# EAGLE design PR9010 (EAGLE 6.6.0)
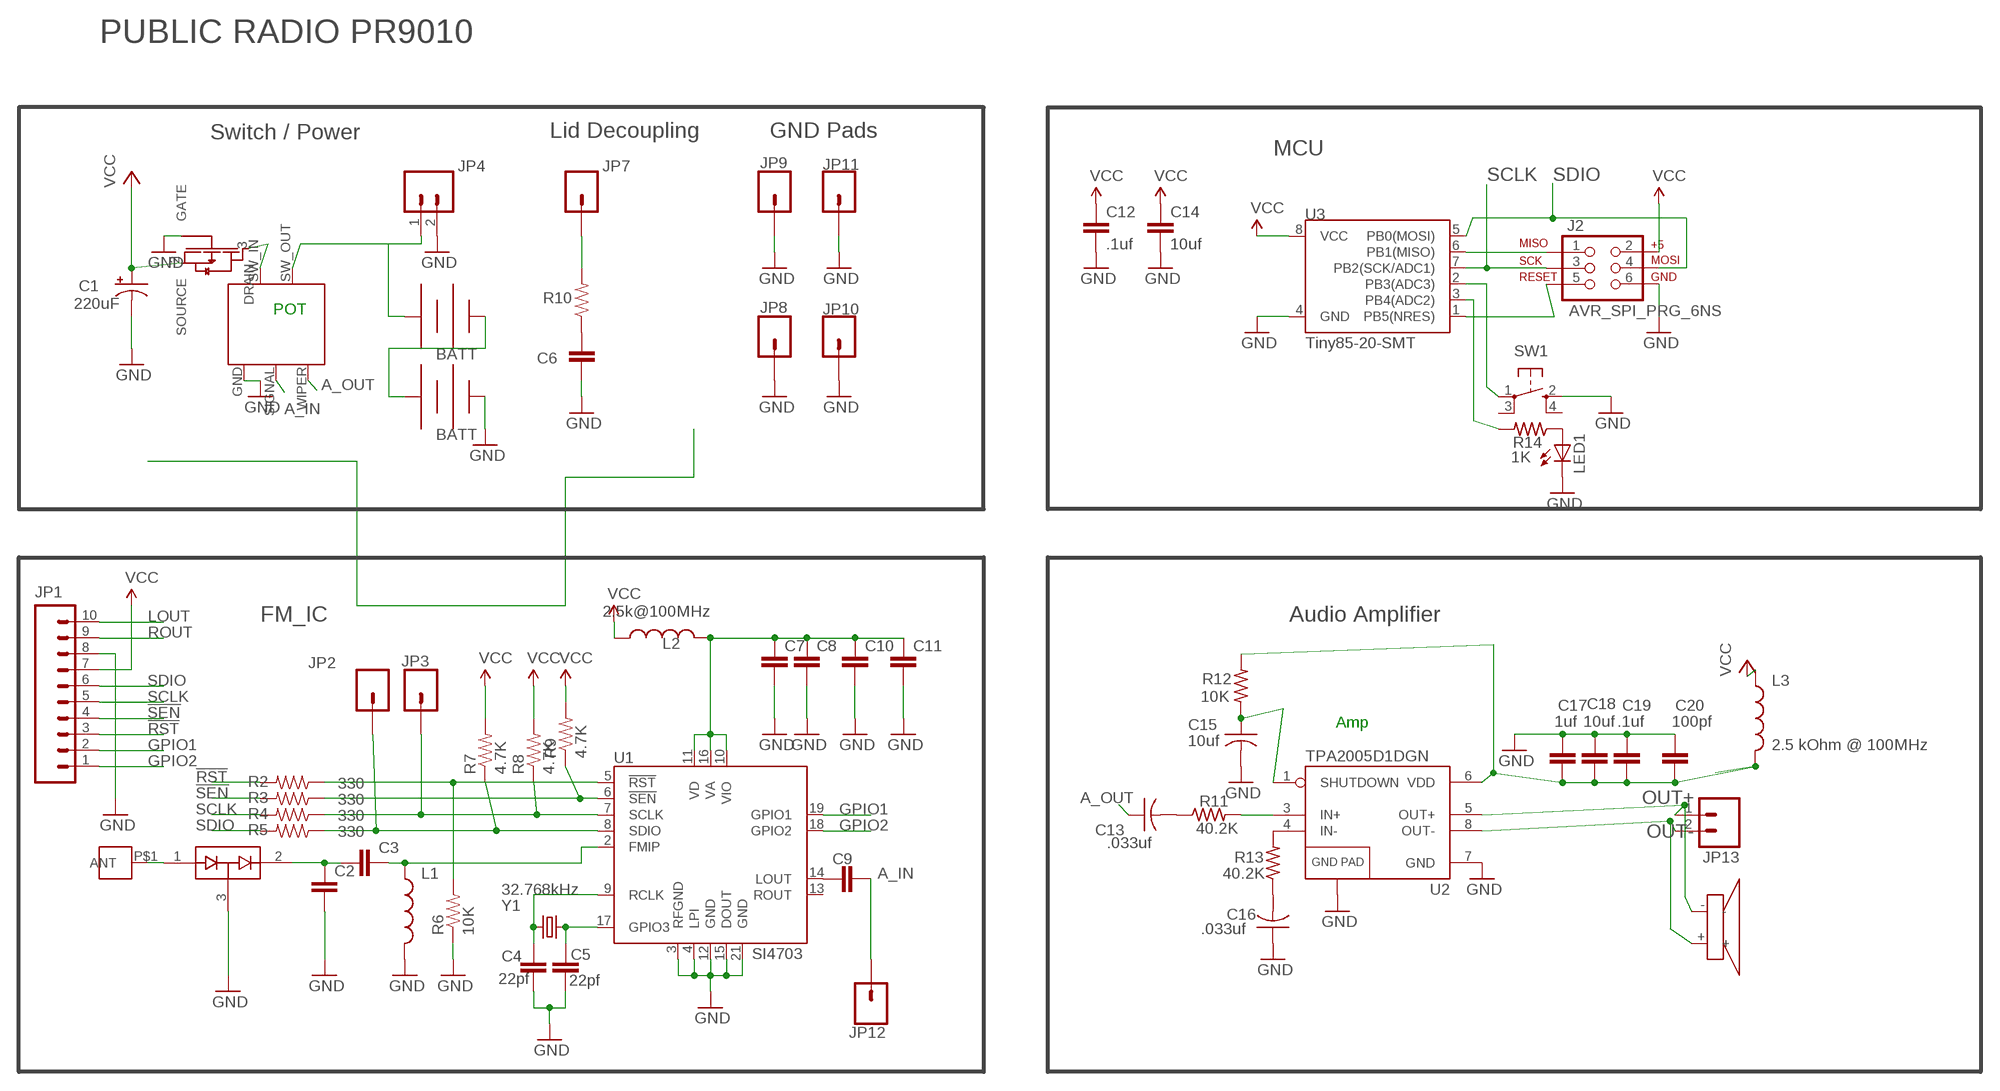
[diagram p0: schematic, sheet 1]

## Parts
C1  220uF  CAP_POLC  [PANASONIC_C]
C2  1.0uF  1.0UF-25V-+80/-20(0805)  [0805]
C3  1.0uF  1.0UF-25V-+80/-20(0805)  [0805]
C4  22pf  CAP0805  [0805]
C5  22pf  CAP0805  [0805]
C6  CAP0805  [0805]
C7  1.0uF  1.0UF-25V-+80/-20(0805)  [0805]
C8  1.0uF  1.0UF-25V-+80/-20(0805)  [0805]
C9  1.0uF  1.0UF-25V-+80/-20(0805)  [0805]
C10  1.0uF  1.0UF-25V-+80/-20(0805)  [0805]
C11  1.0uF  1.0UF-25V-+80/-20(0805)  [0805]
C12  .1uf  CAP0805  [0805]
C13  .033uf  C-USC0603  [C0603]
C14  10uf  CAP0805  [0805]
C15  10uf  C-USC0603  [C0603]
C16  .033uf  C-USC0603  [C0603]
C17  1uf  CAP0805  [0805]
C18  10uf  CAP0805  [0805]
C19  .1uf  CAP0805  [0805]
C20  100pf  CAP0805  [0805]
D1  BAV99  [SOT23]
FET1  SI2333DDS  [SI2333DDS]
J1  M3_SCREW_POST  [M3_SCREW_POST]
J2  AVR_SPI_PRG_6NS  [2X3-NS]
JP1  M10"  [1X10]
JP2  M01PTH  [1X01]
JP3  M01PTH  [1X01]
JP4  M02PTH3  [1X02_LONGPADS]
JP5  BK-92_MPD_AA_BATT_CLIP  [BK-92_MPD_AA_BATT_CLIP]
JP6  BK-92_MPD_AA_BATT_CLIP  [BK-92_MPD_AA_BATT_CLIP]
JP7  M01PTH  [1X01]
JP8  M01PTH  [1X01]
JP9  M01PTH  [1X01]
JP10  M01PTH  [1X01]
JP11  M01PTH  [1X01]
JP12  M01PTH  [1X01]
JP13  M02PTH3  [1X02_LONGPADS]
L1  INDUCTOR0805  [0805]
L2  2.5k@100MHz  INDUCTOR0603  [0603]
L3  2.5 kOhm @ 100MHz  INDUCTOR0603  [0603]
LED1  LEDSML0603  [SML0603]
R1  RV170SF_TAIWANA_POT_SW  [RV170SF_TAIWANA_POT_SW]
R2  330  RESISTOR0805-RES  [0805]
R3  330  RESISTOR0805-RES  [0805]
R4  330  RESISTOR0805-RES  [0805]
R5  330  RESISTOR0805-RES  [0805]
R6  10K  RESISTOR0805-RES  [0805]
R7  4.7K  RESISTOR0805-RES  [0805]
R8  4.7K  RESISTOR0805-RES  [0805]
R9  4.7K  RESISTOR0805-RES  [0805]
R10  RESISTOR0805-RES  [0805]
R11  40.2K  R-US_R0603  [R0603]
R12  10K  R-US_R0603  [R0603]
R13  40.2K  R-US_R0603  [R0603]
R14  1K  R-US_R0603  [R0603]
SW1  SPST_TACT-KMR2  [KMR2]
U1  SI4703  SPARKFUN_SI470X  [SPARKFUN_SI470X]
U2  TPA2005D1DGN  [POWER-SOP8]
U3  Tiny85-20-SMT  ATTINY45TINY85-20-SMT  [SO08-EIAJ]
U$3  CE32A_DAYTON_SPKR  [CE32A_DAYTON_SPKR]
Y1  32.768kHz  CRYSTAL32-SMD  [CRYSTAL-32KHZ-SMD]

## Nets
3.3V: JP1.7 R7.2 R8.2 R9.2 ; supply symbol labelled VCC
!RST: JP1.3 R2.2
!RST-L: R2.1 R6.2 U1.5(!RST)
!SEN: JP1.4 R3.2
!SEN-L: R3.1 R9.1 U1.6(!SEN)
A_IN: C9.2 JP12.1 R1.SIGNAL
A_OUT: C13.1 R1.WIPER
GND: C1.- C2.2 C4.2 C5.2 C6.2 C7.2 C8.2 C10.2 C11.2 C12.2 C14.2 C15.2 C16.1 C17.1 C18.1 C19.1 C20.1 D1.3(COM) FET1.1(GATE) J2.6 JP1.8 JP4.2 JP6.NEG JP6.NEG@2(NEG) JP8.1 JP9.1 JP10.1 JP11.1 L1.2 LED1.C R1.GND R6.1 SW1.2(S) U1.3(RFGND) U1.4(LPI) U1.12(GND) U1.15(DOUT) U1.21(GND) U2.7(GND) U2.9(GND) U3.4(GND)
GPIO1: JP1.2 U1.19(GPIO1)
GPIO2: JP1.1 U1.18(GPIO2)
LOUT: C9.1 JP1.10 U1.14(LOUT)
N$1: C4.1 U1.9(RCLK) Y1.X2
N$2: C5.1 U1.17(GPIO3) Y1.X1
N$3: C13.2 R11.1
N$4: R11.2 U2.3(IN+)
N$5: R13.2 U2.4(IN-)
N$6: C3.2 L1.1 U1.2(FMIP)
N$7: LED1.A R14.1
N$8: JP7.1 R10.2
N$9: C7.1 C8.1 C10.1 C11.1 L2.2 U1.10(VIO) U1.11(VD) U1.16(VA)
N$11: SW1.1(P) U3.2(PB3(ADC3))
N$12: R14.2 U3.3(PB4(ADC2))
N$13: JP5.NEG JP5.NEG@2(NEG) JP6.POS JP6.POS@2(POS)
N$14: D1.1(A1) J1.P$1(ANT)
N$15: JP4.1 JP5.POS JP5.POS@2(POS) R1.SW_OUT
N$17: C2.1 C3.1 D1.2(C2)
N$18: C17.2 C18.2 C19.2 C20.2 L3.2 R12.2 U2.6(VDD)
N$20: C15.1 R12.1 U2.1(SHUTDOWN)
N$23: C16.2 R13.1
N$34: FET1.3(DRAIN) R1.SW_IN
N$35: C6.1 R10.1
OUT+: JP13.1 U2.5(OUT+) U$3.-
OUT-: JP13.2 U2.8(OUT-) U$3.+
PB1: J2.1 U3.6(PB1(MISO))
PB5: J2.5 U3.1(PB5(NRES))
ROUT: JP1.9
SCLK: J2.3 JP1.5 R4.2 U3.7(PB2(SCK/ADC1))
SCLK-L: JP3.1 R4.1 R8.1 U1.7(SCLK)
SDIO: J2.4 JP1.6 R5.2 U3.5(PB0(MOSI))
SDIO-L: JP2.1 R5.1 R7.1 U1.8(SDIO)
VCC: C1.+ C12.1 C14.1 FET1.2(SOURCE) J2.2 L2.1 L3.1 U3.8(VCC)
Unconnected: SW1.3(P1) SW1.4(S1) U1.13(ROUT)

## Notes on the sheet
- PUBLIC RADIO PR9010
- Switch / Power | Lid Decoupling | GND Pads
- MCU
- POT
- FM_IC | Audio Amplifier
- Amp

## Library data of the parts
C1 = SparkFun-Passives:CAP_POL: Capacitor Polarized These are standard SMD and PTH capacitors. Normally 10uF, 47uF, and 100uF in electrolytic and tantalum varieties. Always verify the external diameter of the through hole cap, it varies with capacity, voltage, and manufacturer. The EIA devices should be standard.
C2 C3 C7-C11 = SparkFun-Capacitors:1.0UF-25V-+80/-20(0805); PROD_ID: CAP-11625
C4-C6 C12 C14 C17-C20 = SparkFun-Passives:CAP: Capacitor Standard 0603 ceramic capacitor, and 0.1" leaded capacitor.
C13 C15 C16 = resistor:C-US: CAPACITOR, American symbol
D1 = SparkFun-DiscreteSemi:BAV99: Two small signal silicon diodes connected anode to cathode. Connections to all three nodes available. DIO-10647; PROD_ID: DIO-10647
FET1 = PubRadioLib:SI2333DDS
J1 = PR_Libraries:M3_SCREW_POST
J2 = SparkFun-Connectors:AVR_SPI_PRG_6: AVR ISP 6 Pin This is the reduced ISP connector for AVR programming. Common on Arduino. This footprint will take up less PCB space and can be used with a 10-pin to 6-pin adapter such as SKU: BOB-08508 **Special note about "TEST_POINT" package. The stop mask is on the top side, so if you want your programming test points to be on the bottom of your board, make sure to place this package on the bottom side of the board. This also ensure that the orientation to program from the bottom side will be correct.
JP1 = SparkFun-Connectors:M10: Header 10 Standard 10-pin 0.1" header. Use with straight break away headers (SKU : PRT-00116), right angle break away headers (PRT-00553), swiss pins (PRT-00743), machine pins (PRT-00117), and female headers (PRT-00115).
JP2 JP3 JP7-JP12 = SparkFun-Connectors:M01: Header 1 Standard 1-pin 0.1" header. Use with straight break away headers (SKU : PRT-00116), right angle break away headers (PRT-00553), swiss pins (PRT-00743), machine pins (PRT-00117), and female headers (PRT-00115).
JP4 JP13 = SparkFun-Connectors:M02: Standard 2-pin 0.1" header. Use with - straight break away headers ( PRT-00116) - right angle break away headers (PRT-00553) - swiss pins (PRT-00743) - machine pins (PRT-00117) - female headers (PRT-00115) Molex polarized connector foot print use with: PRT-08233 with associated crimp pins and housings. 2.54_SCREWTERM for use with PRT-10571. 3.5mm Screw Terminal footprints for PRT-08084 5mm Screw Terminal footprints for use with PRT-08432
JP5 JP6 = PR_Libraries:BK-92_MPD_AA_BATT_CLIP
L1-L3 = SparkFun-Passives:INDUCTOR: Inductors Basic Inductor/Choke - 0603 and 1206. Footprints are not proven and vary greatly between part numbers. SRN6045- 33uH, 20% 1.4A SDR0403-560KL - 56uH, 10%, 500mA RMS/740mA peak
LED1 = led:LED: LED OSRAM: - CHIPLED LG R971, LG N971, LY N971, LG Q971, LY Q971, LO R971, LY R971 LH N974, LH R974 LS Q976, LO Q976, LY Q976 LO Q996 - Hyper CHIPLED LW Q18S LB Q993, LB Q99A, LB R99A - SideLED LS A670, LO A670, LY A670, LG A670, LP A670 LB A673, LV A673, LT A673, LW A673 LH A674 LY A675 LS A676, LA A676, LO A676, LY A676, LW A676 LS A679, LY A679, LG A679 - Hyper Micro SIDELED® LS Y876, LA Y876, LO Y876, LY Y876 LT Y87S - SmartLED LW L88C, LW L88S LB L89C, LB L89S, LG L890 LS L89K, LO L89K, LY L89K LS L896, LA L896, LO L896, LY L896 - TOPLED LS T670, LO T670, LY T670, LG T670, LP T670 LSG T670, LSP T670, LSY T670, LOP T670, LYG T670 LG T671, LOG T671, LSG T671 LB T673, LV T673, LT T673, LW T673 LH T674 LS T676, LA T676, LO T676, LY T676, LB T676, LH T676, LSB T676, LW T676 LB T67C, LV T67C, LT T67C, LS T67K, LO T67K, LY T67K, LW E67C LS E67B, LA E67B, LO E67B, LY E67B, LB E67C, LV E67C, LT E67C LW T67C LS T679, LY T679, LG T679 LS T770, LO T770, LY T770, LG T770, LP T770 LB T773, LV T773, LT T773, LW T773 LH T774 LS E675, LA E675, LY E675, LS T675 LS T776, LA T776, LO T776, LY T776, LB T776 LHGB T686 LT T68C, LB T68C - Hyper Mini TOPLED® LB M676 - Mini TOPLED Santana® LG M470 LS M47K, LO M47K, LY M47K Source: http://www.osram.convergy.de LUXEON: - LUMILED® LXK2-PW12-R00, LXK2-PW12-S00, LXK2-PW14-U00, LXK2-PW14-V00 LXK2-PM12-R00, LXK2-PM12-S00, LXK2-PM14-U00 LXK2-PE12-Q00, LXK2-PE12-R00, LXK2-PE12-S00, LXK2-PE14-T00, LXK2-PE14-U00 LXK2-PB12-K00, LXK2-PB12-L00, LXK2-PB12-M00, LXK2-PB14-N00, LXK2-PB14-P00, LXK2-PB14-Q00 LXK2-PR12-L00, LXK2-PR12-M00, LXK2-PR14-Q00, LXK2-PR14-R00 LXK2-PD12-Q00, LXK2-PD12-R00, LXK2-PD12-S00 LXK2-PH12-R00, LXK2-PH12-S00 LXK2-PL12-P00, LXK2-PL12-Q00, LXK2-PL12-R00 Source: www.luxeon.com KINGBRIGHT: KA-3528ASYC Source: www.kingbright.com
R1 = PR_Libraries:RV170SF_TAIWANA_POT_SW
R2-R10 = SparkFun-Passives:RESISTOR: Resistor Basic schematic elements and footprints for 0603, 1206, and PTH resistors.
R11-R14 = resistor:R-US_: RESISTOR, American symbol
SW1 = adafruit:SPST_TACT: SMT 6mm switch, EVQQ2 series http://www.ladyada.net/library/eagle
U1 = FM-Meter-Driver-v11:SPARKFUN_SI470X: Description: This is a powerful FM receiver IC. Tested with Si4703. You really only need SEN, RST, SCLK, and SDIO to get a full FM radio working. Antenna comes from headphone jack. See breakout board on SparkFun website for more information.
U2 = SparkFun-AnalogIC:TPA2005D1: 1.4W MONO CLASS-D AUDIO POWER AMPLIFIER The TPA2005D1 is a 1.4-W high efficiency filter-free class-D audio power amplifier in a BGA, QFN, or MSOP package that requires only three external components. Datasheet: http://focus.ti.com/lit/ds/symlink/tpa2005d1.pdf 1.4 W Into 8 ? From a 5V Supply at THD = 10% (Typ) Maximum Battery Life and Minimum Heat Efficiency With an 8-? Speaker: 84% at 400 mW, 79% at 100 mW 2.8-mA Quiescent Current 0.5-mA Shutdown Current Ideal for Wireless or Cellular Handsets and PDAs Capable of Driving an 8-? Speaker (2.5 V ? VDD ? 5.5 V) and a 4-? Speaker (2.5 V ? VDD ? 4.2 V) Only Three External Components Optimized PWM Output Stage Eliminates LC Output Filter Internally Generated 250-kHz Switching Frequency Eliminates Capacitor and Resistor Improved PSRR (-71 dB at 217 Hz) and Wide Supply Voltage (2.5 V to 5.5 V) Eliminates Need for a Voltage Regulator Fully Differential Design Reduces RF Rectification and Eliminates Bypass Capacitor Improved CMRR Eliminates Two Input Coupling Capacitors
U3 = SparkFun-DigitalIC:ATTINY45: Atmel 8-pin 2/4/8kB flash uC; PROD_ID: IC-09092
U$3 = PR_Libraries:CE32A_DAYTON_SPKR
Y1 = SparkFun:CRYSTAL: Crystals Various standard crystals. Proven footprints. Spark Fun Electronics SKU : COM-00534

## Board
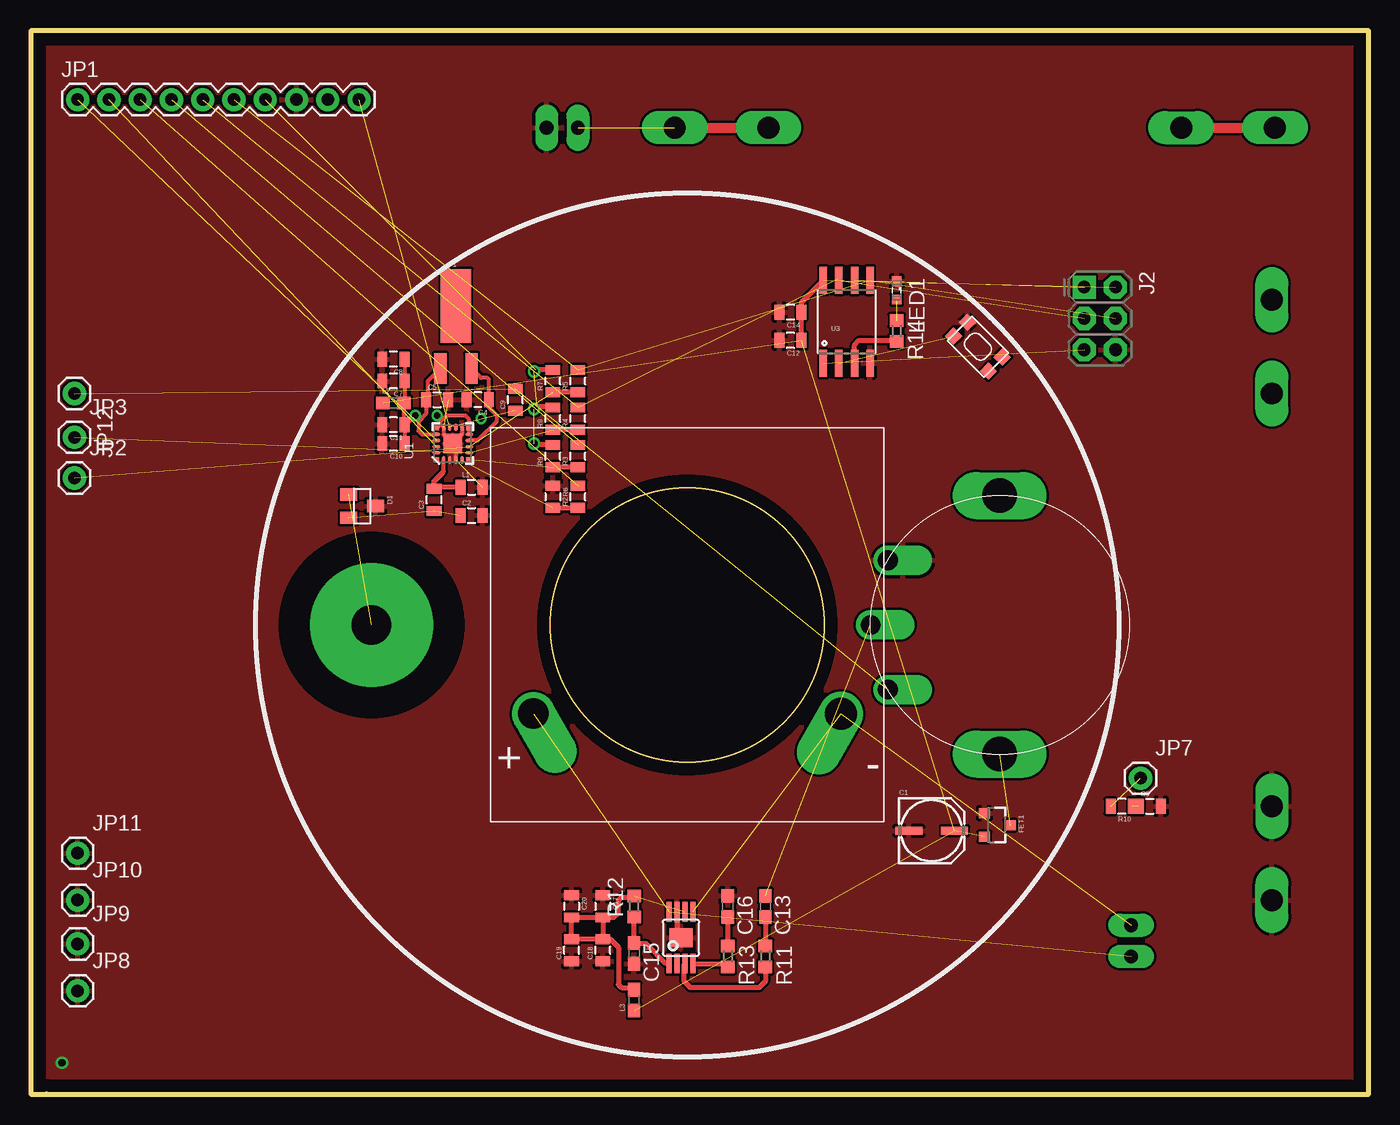
[diagram p1: board, top side]
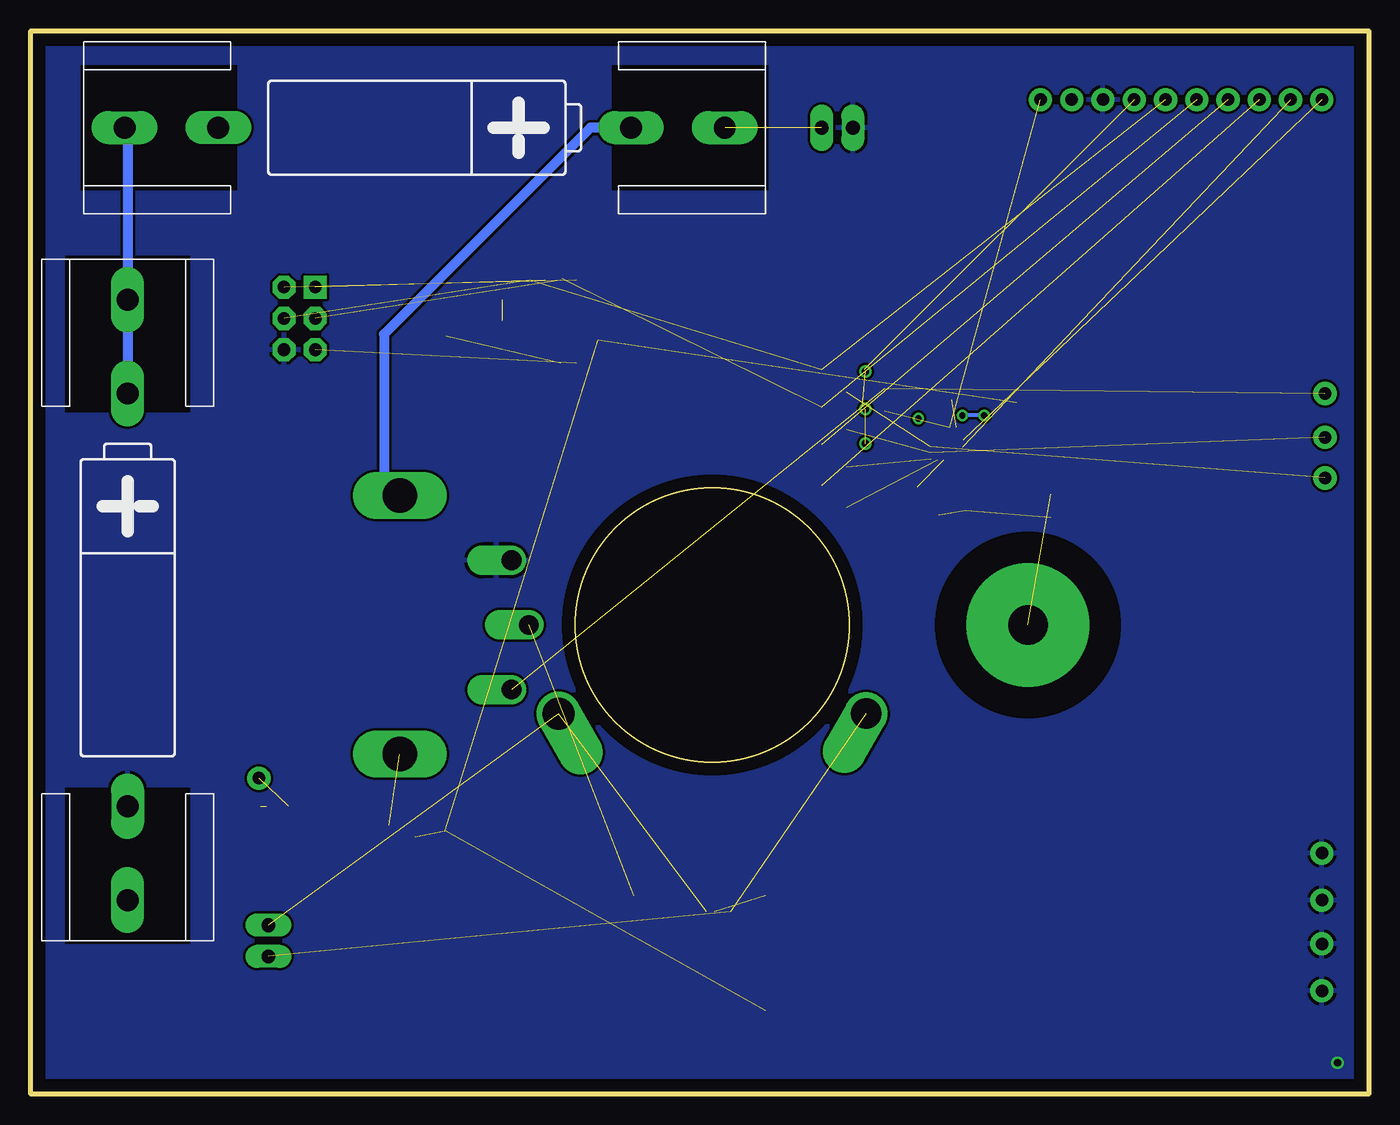
[diagram p2: board, bottom side, seen from below]

Size 108.71 x 86.36 mm. Coordinates in mm from the lower left corner, seen from the top.
Outline: 1.27,0 71.55,0
Outline: 1.27,0 0,0 0,86.36 108.71,86.36 108.71,0 1.27,0
Copper layers (1*16): Top 0.035mm / dielectric 1.5mm / Bottom 0.035mm
Design rules "default": minimum track width 10mil, minimum drill 24mil, track to track 8mil, track to pad 8mil, pad to pad 8mil, via to via 8mil, smd to smd 8mil, copper to edge 40mil, drill to drill 8mil, minimum pad ring 10mil, minimum via ring 8mil, stop-mask expansion 4mil, vias tented up to drill 0mil, thermal gap 10mil

### Footprints (pad centres in the part's own frame; a part is rotated, then mirrored left to right if it is on the bottom)
PANASONIC_C = smd 2.2 x 0.65: + 1.9,-0.2; - -1.8,-0.2
0805 = smd 0.8 x 1.2: 1 -0.9,0; 2 0.9,0
C0603 = smd 1.1 x 1: 1 -0.85,0; 2 0.85,0
SOT23 = smd 1 x 1.4: 1 -0.95,-1.1; 2 0.95,-1.1; 3 0,1.1
SI2333DDS = smd 0.8 x 0.9: 1 -0.95,-1; 2 0.95,-1; 3 0,1.1
M3_SCREW_POST = drill 3.2 pad 10: P$1 0,0
2X3-NS = drill 1.016 pad 1.88 square: 1 -2.54,-1.27 | drill 1.016 pad 1.88 octagon: 2 -2.54,1.27; 3 0,-1.27; 4 0,1.27; 5 2.54,-1.27; 6 2.54,1.27
1X10 = drill 1.016 pad 1.88: 1 0,0; 2 2.54,0; 3 5.08,0; 4 7.62,0; 5 10.16,0; 6 12.7,0; 7 15.24,0; 8 17.78,0; 9 20.32,0; 10 22.86,0
1X01 = drill 1.016 pad 1.88: 1 0,0
1X02_LONGPADS = drill 1.118 pad 1.88 long: 1 0,0; 2 2.54,0
BK-92_MPD_AA_BATT_CLIP = drill 1.778 long: NEG -24.384,0; NEG@2 -16.764,0; POS 16.764,0; POS@2 24.384,0
0603 = smd 1.1 x 1: 1 -0.85,0; 2 0.85,0
SML0603 = smd 0.8 x 0.8: A 0.75,0; C -0.75,0
RV170SF_TAIWANA_POT_SW = drill 1.6 offset: GND -5.25,-9.09; SIGNAL 5.25,-9.09; WIPER 0,-10.5 | drill 2.8 long: SW_IN 10.5,0; SW_OUT -10.5,0
R0603 = smd 1 x 1.1: 1 -0.85,0; 2 0.85,0
KMR2 = smd 1 x 1: 1 2,0.8; 2 2,-0.8; 3 -2,0.8; 4 -2,-0.8
SPARKFUN_SI470X = smd 0.34 x 0.34: 1 -1.275,1.265; 6 -1.265,-1.265; 11 1.265,-1.265; 16 1.265,1.265 | smd 0.61 x 0.28: 2 -1.335,0.75; 3 -1.335,0.25; 4 -1.335,-0.25; 5 -1.335,-0.75; 12 1.335,-0.75; 13 1.335,-0.25; 14 1.335,0.25; 15 1.335,0.75 | smd 0.28 x 0.61: 7 -0.75,-1.335; 8 -0.25,-1.335; 9 0.25,-1.335; 10 0.75,-1.335; 17 0.75,1.335; 18 0.25,1.335; 19 -0.25,1.335; 20 -0.75,1.335 | smd 1.6 x 1.6: 21 0,0
POWER-SOP8 = smd 0.4 x 1.6: 1 -0.975,-2.1; 2 -0.325,-2.1; 3 0.325,-2.1; 4 0.975,-2.1; 5 0.975,2.1; 6 0.325,2.1; 7 -0.325,2.1; 8 -0.975,2.1 | smd 1.89 x 1.57: 9 0,0
SO08-EIAJ = smd 0.61 x 2.21: 1 -1.905,-3.378; 2 -0.635,-3.378; 3 0.635,-3.378; 4 1.905,-3.378; 5 1.905,3.353; 6 0.635,3.353; 7 -0.635,3.353; 8 -1.905,3.353
CE32A_DAYTON_SPKR = drill 2.5 offset: + -12.5,-7.2 | drill 2.6 offset: - 12.5,-7.2
CRYSTAL-32KHZ-SMD = smd 2.5 x 6: SHEILD 0,5.08 | smd 1 x 2.5: X1 -1.27,0; X2 1.27,0

### Placement (x,y rotation side)
C1  73.15,21.59 0 top
C2  35.81,46.99 0 top
C3  32.77,48.26 90 top
C4  36.32,56.39 180 top
C5  33.02,56.39 0 top
C6  90.93,23.37 0 top
C7  29.46,57.91 180 top
C8  29.46,59.69 180 top
C9  39.37,56.39 90 top
C10  29.46,52.83 180 top
C11  29.46,54.36 180 top
C12  61.72,61.21 180 top
C13  59.69,15.24 270 top
C14  61.72,63.5 180 top
C15  49.02,11.43 270 top
C16  56.64,15.24 270 top
C17  46.48,15.24 270 top
C18  46.48,11.68 90 top
C19  43.94,11.68 90 top
C20  43.94,15.24 270 top
D1  26.92,47.75 270 top
FET1  78.49,21.84 270 top
J1  27.69,38.1 0 top
J2  86.87,62.99 270 top
JP1  3.81,80.77 0 top
JP2  3.56,50.04 0 top
JP3  3.56,53.34 0 top
JP4  44.45,78.49 180 top
JP5  76.71,78.49 0 bottom
JP6  100.84,40.13 90 bottom
JP7  90.17,25.65 0 top
JP8  3.81,8.38 0 top
JP9  3.81,12.19 0 top
JP10  3.81,15.75 0 top
JP11  3.81,19.56 0 top
JP12  3.56,56.9 270 top
JP13  89.41,13.72 270 top
L1  35.81,49.28 0 top
L2  29.46,56.13 0 top
L3  49.02,7.62 90 top
LED1  70.36,65.28 270 top
R1  78.74,38.1 270 top
R2  44.45,48.51 90 top
R3  44.45,51.82 90 top
R4  44.45,54.86 90 top
R5  44.45,57.91 90 top
R6  42.42,48.51 270 top
R7  42.42,57.91 90 top
R8  42.42,54.86 90 top
R9  42.42,51.82 90 top
R10  88.65,23.37 180 top
R11  59.69,11.18 270 top
R12  49.02,15.24 90 top
R13  56.64,11.18 270 top
R14  70.36,61.98 270 top
SW1  76.96,60.71 135 top
U1  34.29,52.83 90 top
U2  52.83,12.7 0 top
U3  66.29,62.74 0 top
U$3  53.34,38.1 0 top
Y1  34.54,58.93 0 top

### Tracks (layer width: path | path; a pad name or v marks a point on that pad's centre or on a via)
3.3V  (via drill 0.6)  (3 unrouted)
  Top 0.406: R9.2 41.01,52.72 v40.89,52.83 | v40.89,55.63 41.15,55.88 42.3,55.88 R8.2 | R7.2 41.03,58.81 v40.89,58.67
!RST  (1 unrouted)
!RST-L  (1 unrouted)
  Top 0.406: R6.2 R2.1
!SEN  (1 unrouted)
!SEN-L  (1 unrouted)
  Top 0.406: R3.1 R9.1
A_IN  (2 unrouted)
A_OUT  (1 unrouted)
GND  (via drill 0.6)  (2 unrouted)
  Top 0.305: U1.4 34.54,52.58 U1.21 | U1.15 33.54,53.58 U1.21 | U1.12 35.04,53.61 35.05,53.59 U1.21
  Top 0.406: U2.7 52.51,13.03 U2.9
  other vias: 2.54,2.54
  pour Top: 111.76,-1.27 111,88.9 -1.52,89.66 -0.76,-0.51
  pour Bottom: 111.76,-1.27 110.49,89.41 -2.03,89.92 -0.76,-0.76
GPIO1  (1 unrouted)
GPIO2  (1 unrouted)
LOUT  (2 unrouted)
N$1
  Top 0.305: U1.9 36.32,53.09 37.85,54.61 37.85,55.12 37.22,55.74 C4.1 37.22,58.03 37.08,58.17 36.58,58.17 Y1.X2
N$2
  Top 0.305: Y1.X1 32.26,57.91 32.26,56.53 C5.1 32.12,55.23 31.5,54.61 31.5,53.85 31.75,53.59 32.94,53.59 U1.17
N$3
  Top 0.406: C13.2 R11.1
N$4
  Top 0.406: R11.2 59.69,9.14 59.18,8.64 53.59,8.64 53.09,9.14 53.09,10.53 U2.3
N$5
  Top 0.406: U2.4 56.37,10.6 R13.2
N$6
  Top 0.305: 33.53,50.55 33.53,51.48 U1.2
  Top 0.406: L1.1 32.88,49.28 C3.2 32.77,49.78 33.53,50.55
N$7  (1 unrouted)
N$8  (1 unrouted)
N$9  (via drill 0.5)
  Top 0.305: C8.1 C7.1 30.36,56.18 L2.2 30.31,54.41 C11.1 | C11.1 C10.1 | C11.1 30.48,54.36 v31.24,55.12 | v33.02,55.12 33.27,54.86 33.27,54.35 U1.16 33.02,54.36 33.78,55.12 35.31,55.12 35.56,54.86 U1.11 35.55,53.65 U1.10
  Bottom 0.305: v31.24,55.12 v33.02,55.12
N$10  (via drill 0.5)
  other vias: 36.58,54.86
N$11  (1 unrouted)
N$12
  Top 0.406: U3.3 66.93,60.83 67.31,61.21 70.27,61.21 R14.2
N$13
  Top 0.813: JP5.NEG@2 JP5.NEG | JP5.NEG 101.85,78.49 101.85,78.74 101.09,78.74 JP5.NEG
  Bottom 0.813: JP5.NEG 100.84,78.23 JP6.POS@2 JP6.POS
N$14  (1 unrouted)
N$15  (1 unrouted)
  Top 0.813: JP5.POS@2 JP5.POS
  Bottom 0.813: JP5.POS 63.25,78.49 80.01,61.72 80.01,49.87 R1.SW_OUT
N$17  (2 unrouted)
N$18  (1 unrouted)
  Top 0.406: C17.2 C18.2 | C19.2 43.94,12.7 | 43.94,12.7 C20.2 C17.2 | C18.2 44.06,12.58 43.94,12.7 | C17.2 47.36,14.34 47.75,14.73 47.75,15.75 48.01,16 48.93,16 R12.2 | C18.2 47.11,12.58 47.75,11.94 47.75,8.89 48.01,8.64 48.86,8.64 L3.2
N$20
  Top 0.406: U2.1 51.63,10.6 50.04,12.19 49.11,12.19 C15.1 R12.1
N$23
  Top 0.406: R13.1 C16.2
N$34  (1 unrouted)
N$35  (1 unrouted)
OUT+  (2 unrouted)
OUT-  (2 unrouted)
PB1  (1 unrouted)
PB5  (1 unrouted)
SCLK  (3 unrouted)
  Top 0.406: 65.53,66.22 U3.7
SCLK-L  (2 unrouted)
  Top 0.406: R4.1 R8.1
SDIO  (3 unrouted)
SDIO-L  (2 unrouted)
  Top 0.406: R5.1 R7.1
VCC  (5 unrouted)
  Top 0.406: C12.1 C14.1 62.62,64.32 U3.8